# Altium schematic sheet Multiplier_channel.SchDoc: Modulator v1.0
size 420 x 297 mm; Author: shanasz; CompanyName: WUT; DrawnBy: shanasz; Organization: WUT ISE; Address1: Warsaw Univeristy of Technology; Address2: Nowowiejska 15/19; DocumentNumber: 4; Revision: -; SheetNumber: 4; SheetTotal: 6; EDA_Number: ARTIQ; Projet: ARTIQ/SINARA; ModifiedBy: -; CreateDate: XX/XX/XXXX; CheckedDate: -; Title2: Modulator channel; DivGrp: ISE; Designer: shanasz; ModifiedDate: -; ProjectName: ARTIQ/SINARA
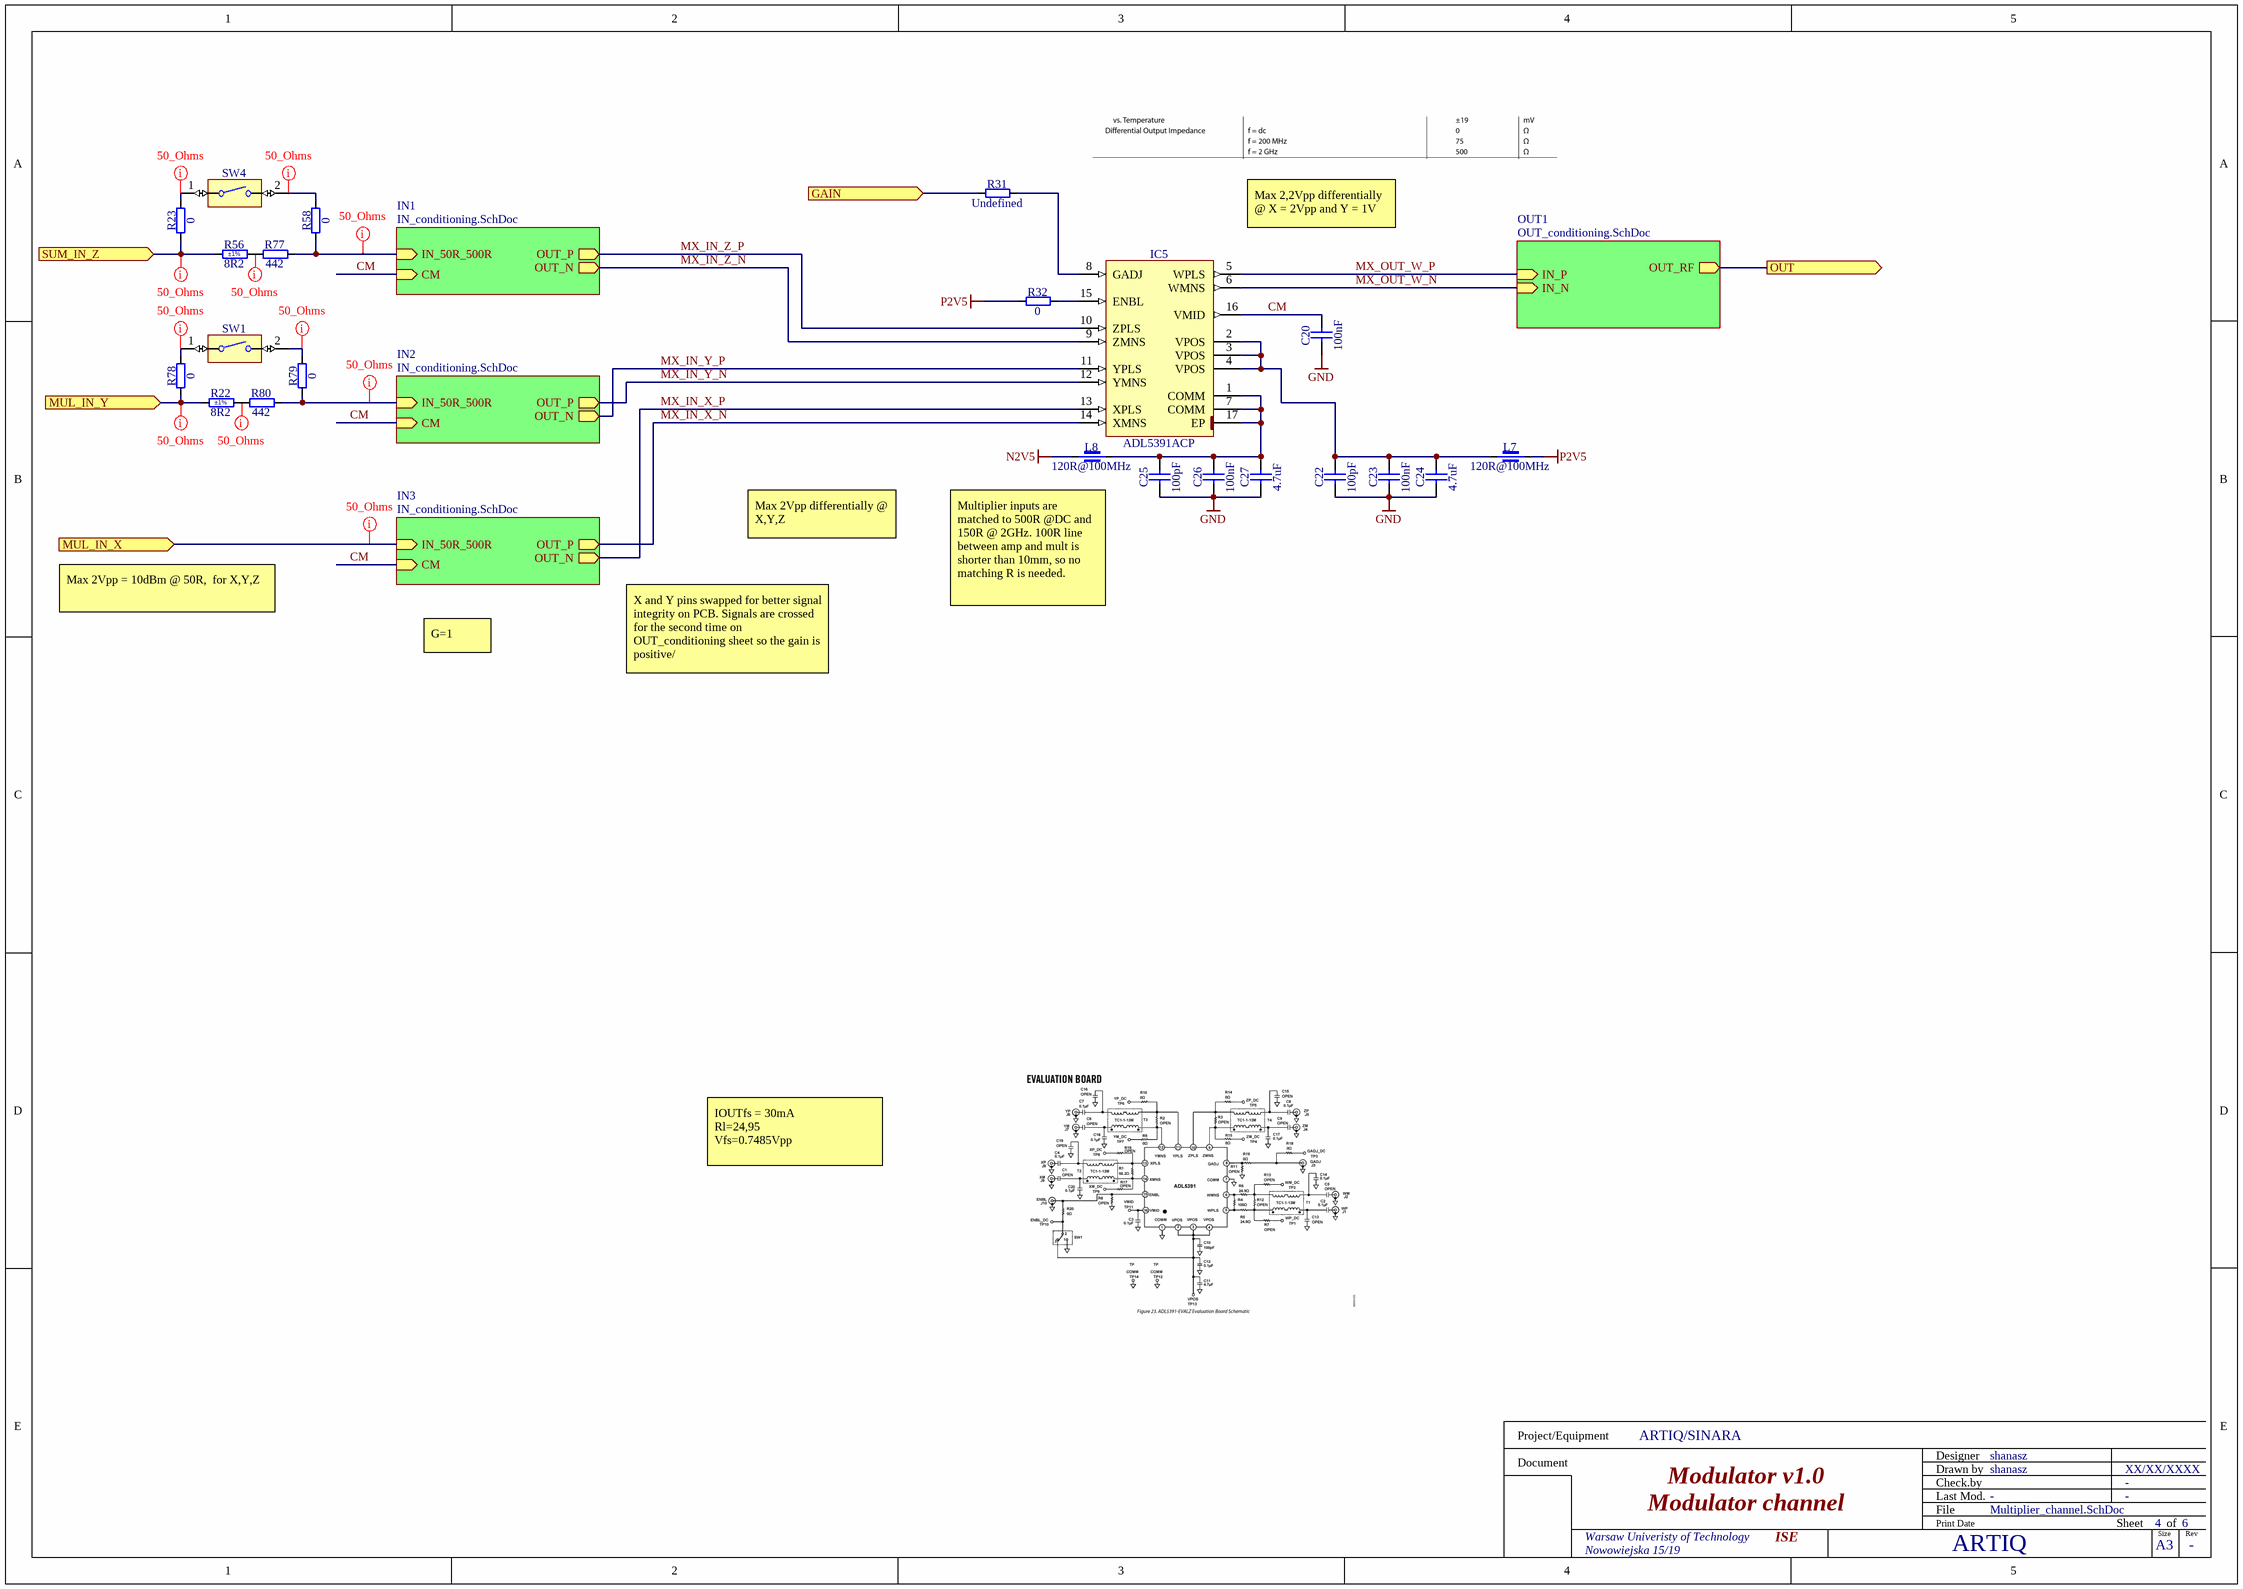
[diagram p0: Multiplier_channel.SchDoc]

## Parts
C20  100nF  [CAPC1005X55N]
C22  100pF  [CAPC1005X55N]
C23  100nF  [CAPC1005X55N]
C24  4.7uF  [CAPC1005X55N]
C25  100pF  [CAPC1005X55N]
C26  100nF  [CAPC1005X55N]
C27  4.7uF  [CAPC1005X55N]
IC5  ADL5391ACP  [QFN50P300X300X100-17N-S145]
L7  120R@100MHz  [INDC1005X55N]
L8  120R@100MHz  [INDC1005X55N]
R22  8R2  Tolerance: ±1%  [RESC1005X40N]
R23  0  [RESC1005X40N]
R31  Undefined  [RESC1005X40N]
R32  0  [RESC1005X40N]
R56  8R2  Tolerance: ±1%  [RESC1005X40N]
R58  0  [RESC1005X40N]
R77  442  [RESC1005X40N]
R78  0  [RESC1005X40N]
R79  0  [RESC1005X40N]
R80  442  [RESC1005X40N]
SW1  Switch  [SW_OMRON_A6SN-1101]  (value not drawn)
SW4  Switch  [SW_OMRON_A6SN-1101]  (value not drawn)

## Sub-sheets
IN1 = IN_conditioning.SchDoc: IN_50R_500R (in), OUT_P (out), OUT_N (out), CM (in)
IN2 = IN_conditioning.SchDoc: IN_50R_500R (in), OUT_P (out), OUT_N (out), CM (in)
IN3 = IN_conditioning.SchDoc: IN_50R_500R (in), OUT_P (out), OUT_N (out), CM (in)
OUT1 = OUT_conditioning.SchDoc: OUT_RF (out), IN_P (in), IN_N (in)

## Ports
GAIN (in), MUL_IN_X (in), MUL_IN_Y (in), OUT (out), SUM_IN_Z (in)

## Nets
GND: C20.1 C22.1 C23.1 C24.1 C25.1 C26.1 C27.1
N2V5: L8.1
P2V5: L7.2 R32.1
CM: C20.2 IC5.16(VMID) ; sheet IN1/CM, sheet IN2/CM, sheet IN3/CM
GAIN: R31.1 ; port GAIN
MUL_IN_X: port MUL_IN_X, sheet IN3/IN_50R_500R
MUL_IN_Y: R22.1 R78.1 ; port MUL_IN_Y
MX_IN_X_N: IC5.14(XMNS) ; sheet IN3/OUT_P
MX_IN_X_P: IC5.13(XPLS) ; sheet IN3/OUT_N
MX_IN_Y_N: IC5.12(YMNS) ; sheet IN2/OUT_P
MX_IN_Y_P: IC5.11(YPLS) ; sheet IN2/OUT_N
MX_IN_Z_N: IC5.9(ZMNS) ; sheet IN1/OUT_N
MX_IN_Z_P: IC5.10(ZPLS) ; sheet IN1/OUT_P
MX_OUT_W_N: IC5.6(WMNS) ; sheet OUT1/IN_N
MX_OUT_W_P: IC5.5(WPLS) ; sheet OUT1/IN_P
OUT: port OUT, sheet OUT1/OUT_RF
SUM_IN_Z: R23.1 R56.1 ; port SUM_IN_Z
NetC22_2: C22.2 C23.2 C24.2 IC5.2(VPOS) IC5.3(VPOS) IC5.4(VPOS) L7.1
NetC25_2: C25.2 C26.2 C27.2 IC5.1(COMM) IC5.7(COMM) IC5.17(EP) L8.2
NetIC5_8: IC5.8(GADJ) R31.2
NetIC5_15: IC5.15(ENBL) R32.2
NetR22_2: R22.2 R80.1
NetR23_2: R23.2 SW4.1
NetR56_2: R56.2 R77.1
NetR58_1: R58.1 R77.2 ; sheet IN1/IN_50R_500R
NetR58_2: R58.2 SW4.2
NetR78_2: R78.2 SW1.1
NetR79_1: R79.1 R80.2 ; sheet IN2/IN_50R_500R
NetR79_2: R79.2 SW1.2

## Layout directives
net class 50_Ohms: MUL_IN_X, MUL_IN_Y, NetR22_2, NetR23_2, NetR56_2, NetR58_1, NetR58_2, NetR78_2, NetR79_1, NetR79_2, SUM_IN_Z

## Notes on the sheet
- Max 2,2Vpp differentially @ X = 2Vpp and Y = 1V
- Max 2Vpp differentially @ X,Y,Z
- Max 2Vpp = 10dBm @ 50R,  for X,Y,Z
- G=1
- X and Y pins swapped for better signal integrity on PCB. Signals are crossed for the second time on OUT_conditioning sheet so the gain is positive/
- Multiplier inputs are matched to 500R @DC and 150R @ 2GHz. 100R line between amp and mult is shorter than 10mm, so no matching R is needed.
- IOUTfs = 30mA
  Rl=24,95
  Vfs=0.7485Vpp
- Project/Equipment
- Document
- Designer
- Drawn by
- Check.by
- File
- Last Mod.
- Print Date
- Sheet
- Size
- A3
- of
- Rev

## Library data of the parts
C20 C23 C26 = CC0402_100NF_16V_10%_X5R: Non-polarised capacitor; Part Description: SMD Multilayer Chip Ceramic Capacitor; Manufacturer: GENERIC; Manufacturer1 Part Number: GRM155R61C104KA88D; Voltage: 16V; TC: X5R; Tolerance: ±10%; Part Number: CC0402_100NF_16V_10%_X5R; Component Kind: Standard; Component Type: Standard; Pin Count: 2; Value: 100nF; Status: None; Manufacturer Part Number: CC0402_100NF_16V_10%_X5R; Case: 0402; Mounted: Yes; Socket: No; SMD: Yes; Sense: No; Manufacturer1 Example: MURATA; Manufacturer1 ComponentHeight: 0.55mm; HelpURL: \\cern.ch\dfs\Applications\Altium\Datasheets\CC0402_X5R_MURATA_GRM.pdf; Author: CERN DEM JLC; CreateDate: 10.12.2013; LatestRevisionDate: 10.12.2013
C22 C25 = CC0402_100PF_50V_2%_C0G: Non-polarised capacitor; Part Description: SMD Multilayer Chip Ceramic Capacitor; Manufacturer: GENERIC; Manufacturer Part Number: CC0402_100PF_50V_5%_C0G; Manufacturer1 Part Number: C0402C101G5GAC; Voltage: 50V; TC: C0G/NP0; Tolerance: ±2%; Part Number: CC0402_100PF_50V_2%_C0G; Component Kind: Standard; Component Type: Standard; Pin Count: 2; Value: 100pF; Status: Preferred; Case: 0402; Mounted: Yes; Socket: No; SMD: Yes; Sense: No; Manufacturer1 Example: KEMET; Manufacturer1 ComponentHeight: 0.55mm; HelpURL: \\cern.ch\dfs\Applications\Altium\Datasheets\CC0402_C0G_KEMET_(Commercial Grade).pdf; Author: CERN DEM BC; CreateDate: 15.06.2020; LatestRevisionDate: 15.06.2020
C24 C27 = CC0402_4.7UF_4V_20%_X5R: Non-polarised capacitor; Part Description: SMD Multilayer Chip Ceramic Capacitor; Manufacturer: GENERIC; Manufacturer1 Part Number: C0402C475M7PAC; Voltage: 4V; TC: X5R; Tolerance: ±20%; Part Number: CC0402_4.7UF_4V_20%_X5R; Component Kind: Standard; Component Type: Standard; Pin Count: 2; Value: 4.7uF; Status: Preferred; Manufacturer Part Number: CC0402_4.7UF_4V_20%_X5R; Case: 0402; Mounted: Yes; Socket: No; SMD: Yes; Sense: No; Manufacturer1 Example: KEMET; Manufacturer1 ComponentHeight: 0.55mm; HelpURL: \\cern.ch\dfs\Applications\Altium\Datasheets\CC0402_X5R_KEMET.pdf; Author: CERN DEM JLC; CreateDate: 08.06.2010; LatestRevisionDate: 08.06.2010
IC5 = ADL5391ACP: DC to 2.0 GHz Multiplier; Manufacturer: ANALOG DEVICES; PressFit: No; Bonding: No; Part Number: ADL5391ACP; Component Kind: Standard; Component Type: Standard; Device: ADL5391ACP; Footprint: QFN50P300X300X80-17N-S165; PackageDescription: QFN, 0.50mm Pitch, Square; 16 Pin, 3.00mm L X 3.00mm W X 0.80mm H body (w/Thermal Tab 1.65 X 1.65mm), IPC Medium Density; Part Description: DC to 2.0 GHz Multiplier; Manufacturer Part Number: ADL5391ACP; Pin Count: 17; Case: QFN16; Mounted: Yes; Socket: No; SMD: Yes; Sense: No; ComponentHeight: 0.8mm; Author: CERN DEM HF; HelpURL: \\cern.ch\dfs\Applications\Altium\Datasheets\ADL5391.pdf; CreateDate: 03.08.2022; LatestRevisionDate: 03.08.2022
L7 L8 = IND0402_MURATA_BLM15PX121SN1D: Part Description: SMD EMIFIL Chip Ferrite Bead; Manufacturer: MURATA; Power: 2A; Resistance: 0.055R; Tolerance: ±25%; Part Number: IND0402_MURATA_BLM15PX121SN1D; Component Kind: Standard; Component Type: Standard; Pin Count: 2; Value: 120R@100MHz; Manufacturer Part Number: BLM15PX121SN1D; Case: 0402; Mounted: Yes; Socket: No; SMD: Yes; Sense: No; ComponentHeight: 0.55mm; HelpURL: \\cern.ch\dfs\Applications\Altium\Datasheets\IND0402_MURATA_BLM15PX.pdf; Author: CERN DEM JMW; CreateDate: 19.02.2014; LatestRevisionDate: 25.10.2018
R22 R56 = R0402_8R2_1%_0.0625W_200PPM: Resistor - 1%; Part Description: General Purpose Thick Film Chip Resistor; Manufacturer: GENERIC; Manufacturer1 Part Number: 232270678208L; TC: ±200ppm/°C; PressFit: No; Part Number: R0402_8R2_1%_0.0625W_200PPM; Component Kind: Standard; Component Type: Standard; Pin Count: 2; Value: 8R2; Status: Not Recommended; Power: 0.0625W; Manufacturer Part Number: R0402_8R2_1%_0.0625W_200PPM; Case: 0402; Mounted: Yes; Sense: No; Socket: No; SMD: Yes; Manufacturer1 Example: YAGEO PHYCOMP; Manufacturer1 ComponentHeight: 0.4mm; HelpURL: \\cern.ch\dfs\Applications\Altium\Datasheets\R0402_Phycomp_RC0402.pdf; Author: CERN DEM JLC; CreateDate: 03.12.2007; LatestRevisionDate: 17.10.2012
R23 R32 R58 R78 R79 = R0402_0R_JUMPER: Resistor; Part Description: 1A (0.05R Max DC Resistance) Zero Ohm Jumper; Manufacturer: GENERIC; Manufacturer1 Part Number: 232270591001L; PressFit: No; Part Number: R0402_0R_JUMPER; Component Kind: Standard; Component Type: Standard; Pin Count: 2; Value: 0; Status: Not Recommended; Manufacturer Part Number: R0402_0R_JUMPER; Case: 0402; Mounted: Yes; Sense: No; Socket: No; SMD: Yes; Manufacturer1 Example: YAGEO PHYCOMP; Manufacturer1 ComponentHeight: 0.4mm; HelpURL: \\cern.ch\dfs\Applications\Altium\Datasheets\R0402_Phycomp_RC0402.pdf; Author: CERN DEM JLC; CreateDate: 03.12.2007; LatestRevisionDate: 17.10.2012
R31 = R0402_NO-VALUE: Resistor; Part Description: Reserved Footprint For a 0402 (1005) Chip Resistor; PressFit: No; Mounted: No; Part Number: R0402_NO-VALUE; Component Kind: Standard; Component Type: Standard; Pin Count: 2; Value: Undefined; Status: None; Manufacturer: Undefined; Manufacturer Part Number: R0402_NO-VALUE; Case: 0402; Sense: No; Socket: No; SMD: Yes; Manufacturer1 Example: Undefined; Manufacturer1 Part Number: Undefined; Manufacturer1 ComponentHeight: Undefined; HelpURL: Undefined; Author: CERN DEM JLC; CreateDate: 03.12.2007; LatestRevisionDate: 13.03.2008
R77 R80 = R0402_442R_0.1%_0.063W_25PPM: Resistor - 0.1%; Part Description: Thin Film Chip Resistor; Manufacturer: GENERIC; Manufacturer1 Part Number: TNPW0402442RBEED; TC: ±25ppm; PressFit: No; Part Number: R0402_442R_0.1%_0.063W_25PPM; Component Kind: Standard; Component Type: Standard; Pin Count: 2; Value: 442; Status: Not Recommended; Manufacturer Part Number: R0402_442R_0.1%_0.063W_25PPM; Case: 0402; Mounted: Yes; Sense: No; Socket: No; SMD: Yes; Manufacturer1 Example: Vishay / Dale; Author: SHA
SW1 SW4 = SW_OMRON_A6SN-1101: 1 Ways SPST DIP Switch; Part Description: 1 Way SPST Surface-Mounting Slide Switch With Flat Actuator, Contact Rating 25mA 24VDC; Manufacturer: OMRON; PressFit: No; Part Number: SW_OMRON_A6SN-1101; Component Kind: Standard; Component Type: Standard; Pin Count: 2; PackageDescription: Body 4.48x7.5mm, 1 Way SPST Surface-Mounting Slide Switch With Flat Actuator (A6SN Series); Family: Switch; Mounted: Yes; Socket: No; SMD: Yes; Sense: No; Status: None; Manufacturer Part Number: A6SN-1101; ComponentHeight: 4.6mm; HelpURL: \\cern.ch\dfs\Applications\Altium\Datasheets\SW_OMRON_A6SN-1101.pdf; Author: CERN DEM JLC; CreateDate: 25.02.2013; LatestRevisionDate: 25.02.2013